# EAGLE design Esp32_Shield (EAGLE 9.6.2)
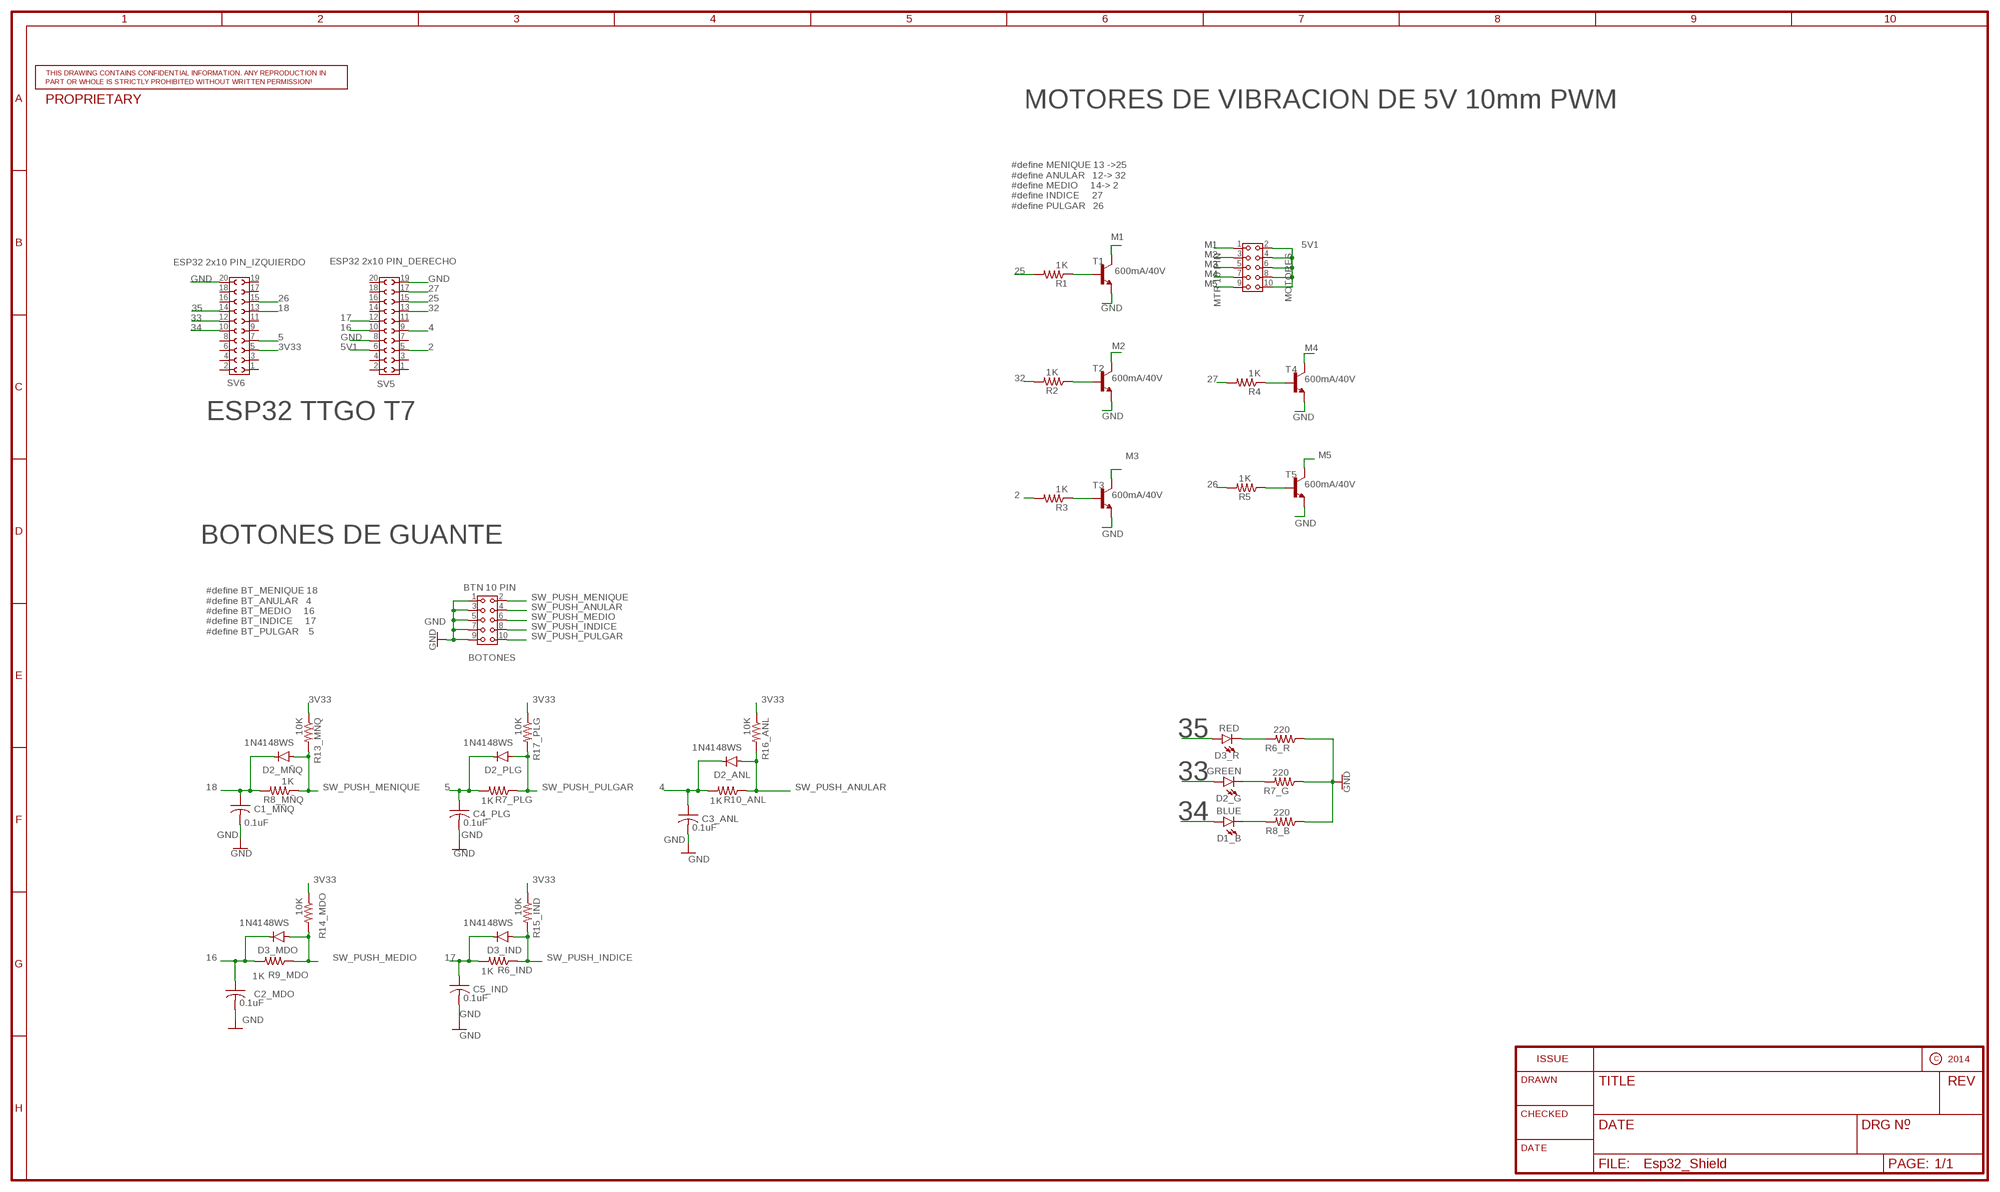
[diagram p0: schematic, sheet 1]

## Parts
BOTONES  BTN 10 PIN  6130XX21821_61301021821  [61301021821]
C1_MÑQ  0.1uF  C-USC0805  [C0805]
C2_MDO  0.1uF  C-USC0805  [C0805]
C3_ANL  0.1uF  C-USC0805  [C0805]
C4_PLG  0.1uF  C-USC0805  [C0805]
C5_IND  0.1uF  C-USC0805  [C0805]
D1_B  BLUE  LED-BLUE1206  [LED-1206]
D2_ANL  1N4148WS  [SOD-323]
D2_G  GREEN  LED-GREEN1206  [LED-1206]
D2_MÑQ  1N4148WS  [SOD-323]
D2_PLG  1N4148WS  [SOD-323]
D3_IND  1N4148WS  [SOD-323]
D3_MDO  1N4148WS  [SOD-323]
D3_R  RED  LED-RED1206  [LED-1206]
MOTORES  MTR 10 PIN  6130XX21821_61301021821  [61301021821]
R1  1K  R-US_R0805  [R0805]
R2  1K  R-US_R0805  [R0805]
R3  1K  R-US_R0805  [R0805]
R4  1K  R-US_R0805  [R0805]
R5  1K  R-US_R0805  [R0805]
R6_IND  1K  R-US_R0805  [R0805]
R6_R  220  R-US_R0805  [R0805]
R7_G  220  R-US_R0805  [R0805]
R7_PLG  1K  R-US_R0805  [R0805]
R8_B  220  R-US_R0805  [R0805]
R8_MÑQ  1K  R-US_R0805  [R0805]
R9_MDO  1K  R-US_R0805  [R0805]
R10_ANL  1K  R-US_R0805  [R0805]
R13_MÑQ  10K  R-US_R0805  [R0805]
R14_MDO  10K  R-US_R0805  [R0805]
R15_IND  10K  R-US_R0805  [R0805]
R16_ANL  10K  R-US_R0805  [R0805]
R17_PLG  10K  R-US_R0805  [R0805]
SV5  ESP32 2x10 PIN_DERECHO  6130XX21821_61302021821  [61302021821]
SV6  ESP32 2x10 PIN_IZQUIERDO  6130XX21821_61302021821  [61302021821]
T1  600mA/40V  TRANS_NPN-MMBT2222AL  [SOT23-3]
T2  600mA/40V  TRANS_NPN-MMBT2222AL  [SOT23-3]
T3  600mA/40V  TRANS_NPN-MMBT2222AL  [SOT23-3]
T4  600mA/40V  TRANS_NPN-MMBT2222AL  [SOT23-3]
T5  600mA/40V  TRANS_NPN-MMBT2222AL  [SOT23-3]

## Nets
2: R3.2 SV5.5
3V33: R13_MÑQ.1 R14_MDO.1 R15_IND.1 R16_ANL.1 R17_PLG.1 SV6.5
4: C3_ANL.1 D2_ANL.C R10_ANL.2 SV5.9
5: C4_PLG.1 D2_PLG.C R7_PLG.2 SV6.7
5V1: MOTORES.2 MOTORES.4 MOTORES.6 MOTORES.8 MOTORES.10 SV5.6
16: C2_MDO.1 D3_MDO.C R9_MDO.2 SV5.10
17: C5_IND.1 D3_IND.C R6_IND.2 SV5.12
18: C1_MÑQ.1 D2_MÑQ.C R8_MÑQ.2 SV6.13
25: R1.2 SV5.15
26: R5.2 SV6.15
27: R4.2 SV5.17
32: R2.2 SV5.13
33: D2_G.A SV6.12
34: D1_B.A SV6.10
35: D3_R.A SV6.14
GND: BOTONES.1 BOTONES.3 BOTONES.5 BOTONES.7 BOTONES.9 C1_MÑQ.2 C2_MDO.2 C3_ANL.2 C4_PLG.2 C5_IND.2 R6_R.1 R7_G.1 R8_B.1 SV5.8 SV5.19 SV6.20 T1.2(E) T2.2(E) T3.2(E) T4.2(E) T5.2(E)
M1: MOTORES.1 T1.3(C)
M2: MOTORES.3 T2.3(C)
M3: MOTORES.5 T3.3(C)
M4: MOTORES.7 T4.3(C)
M5: MOTORES.9 T5.3(C)
N$1: R2.1 T2.1(B)
N$2: R1.1 T1.1(B)
N$3: R3.1 T3.1(B)
N$4: D3_R.C R6_R.2
N$5: D2_G.C R7_G.2
N$6: D1_B.C R8_B.2
N$11: R4.1 T4.1(B)
N$13: R5.1 T5.1(B)
SW_PUSH_ANULAR: BOTONES.4 D2_ANL.A R10_ANL.1 R16_ANL.2
SW_PUSH_INDICE: BOTONES.8 D3_IND.A R6_IND.1 R15_IND.2
SW_PUSH_MEDIO: BOTONES.6 D3_MDO.A R9_MDO.1 R14_MDO.2
SW_PUSH_MENIQUE: BOTONES.2 D2_MÑQ.A R8_MÑQ.1 R13_MÑQ.2
SW_PUSH_PULGAR: BOTONES.10 D2_PLG.A R7_PLG.1 R17_PLG.2
Unconnected: SV5.1 SV5.2 SV5.3 SV5.4 SV5.7 SV5.11 SV5.14 SV5.16 SV5.18 SV5.20 SV6.1 SV6.2 SV6.3 SV6.4 SV6.6 SV6.8 SV6.9 SV6.11 SV6.16 SV6.17 SV6.18 SV6.19

## Notes on the sheet
- MOTORES DE VIBRACION DE 5V 10mm PWM
- #define MENIQUE 13 ->25
  #define ANULAR   12-> 32
  #define MEDIO     14-> 2
  #define INDICE     27
  #define PULGAR   26
- ESP32 TTGO T7
- BOTONES DE GUANTE
- #define BT_MENIQUE 18
  #define BT_ANULAR   4
  #define BT_MEDIO     16
  #define BT_INDICE     17
  #define BT_PULGAR    5

## Library data of the parts
BOTONES MOTORES = Wurth_Connectors_WR-PHD:6130XX21821_61301021821: WR-PHD 2.54 mm Dual Socket Header ARTICLE PROPERTIES: Pins:4;​ 6;​ 8;​ 10;​ 12;​ 14;​ 16;​ 18;​ 20;​ 22;​ 24;​ 26;​ 28;​ 30;​ 32;​ 34;​ 36;​ 40;​ 44;​ 64;​ 72 KIND PROPERTIES: Pitch：2.54 mm Quality Class:3 as per CECC 75 301-802 Rows：Dual Gender：Socket Header Type：Straight MATERIAL PROPERTIES: Insulator Material :PBT Insulator Flammability Rating:UL94 V-0 Contact Material:Copper Alloy Contact Plating:Gold Contact Type:Stamped GENERAL INFORMATION Operating Temperature:-40 up to +125 °C Compliance:Lead free / RoHS ELECTRICAL PROPERTIES: Rated Current:3 A IR 1:3 A Withstanding Voltage:500 V (AC) Contact Resistance:20 mΩ RISO:1000 MΩ CERTIFICATION UL Approval:E323964 PACKAGING PROPERTIES Packaging:Tray <https://katalog.we-online.com/media/images/v2/o57948v209%20Family_Dual_Socket_Header_WR-PHD_6130xx21821.jpg> Details see: https://katalog.we-online.com/en/em/PHD_2_54_DUAL_SOCKET_HEADER_6130XX21821 Updated by Yingchun,Shan 2019-10-21 2019 (C) Würth Elektronik; DATASHEET-URL: https://katalog.we-online.com/em/datasheet/61301021821.pdf; GENDER: Socket Header; IR: 3A; MATES: WR-PHD 2.54mm SMT Dual Pin Header/THT Angled Dual Pin Header/THT Dual Board Stacker/THT Dual Pin Header; PACKAGING: Tray; PART-NUMBER: 61301021821; PINS: 10; ROWS: Dual; TYPE: Straight
C1_MÑQ C2_MDO C3_ANL C4_PLG C5_IND = resistor:C-US: CAPACITOR, American symbol
D1_B = SparkFun-LED:LED-BLUE: Blue SMD LED Used in manufacturing of various products at SparkFun Packages: 0603 - SMD 0603 package [Product Link] <http://www.digikey.com/product-detail/en/SMLE12BC7TT86/511-1589-2-ND/1641808> 1206 - SMD1206 package [Product Link] <http://www.digikey.com/product-detail/en/lite-on-inc/LTST-C150TBKT/160-1643-1-ND/573584> SparkFun Products: ESP8266 Thing-Dev Board <https://www.sparkfun.com/products/13711> RedBoard <https://www.sparkfun.com/products/12757>; PROD_ID: DIO-09911
D2_ANL D2_MÑQ D2_PLG D3_IND D3_MDO = Diodes:1N4148WS: DIODE GEN PURP 75V 150MA SOD323F Manufacturer's datasheet <https://www.onsemi.com/pub/Collateral/1N914BWS-D.pdf>; CREATED_BY: PCBLayout.com; DIGIKEY_PART_NUMBER: 1N4148WSFSTR-ND; MANUFACTURER: Diodes Incorporated; MPN: 1N4148WS; PACKAGE: SOD-323
D2_G = SparkFun-LED:LED-GREEN: Green SMD LED Used in manufacturing of various products at SparkFun Packages: 0603 - SMD 0603 package [Product Link] <http://www.futureelectronics.com/en/technologies/semiconductors/optoelectronics/leds/Pages/9894312-LTST-C190GKT.aspx?CrossPart=HSMG-C190&IM=0> LilyPad 1206 - SMD1206 LilyPad package [Product Link] <http://www.futureelectronics.com/en/Technologies/Product.aspx?ProductID=IN150NGHARVATEKCORPORATION2049943&IM=0> 1206 - SMD1206 package [Product Link] <http://www.futureelectronics.com/en/technologies/semiconductors/optoelectronics/leds/Pages/8315665-LTST-C150KGKT.aspx?IM=0> 1206 Bottom Mount -SMD 1206 Bottom Mount [Product Link] <http://www.digikey.com/product-detail/en/lite-on-inc/LTST-C230KGKT/160-1456-1-ND/386854> SparkFun Products: Pro Mini 328 -5V <https://www.sparkfun.com/products/821> RedBoard <https://www.sparkfun.com/products/12757> MP3 Trigger <https://www.sparkfun.com/products/13720> Makey Makey <https://www.sparkfun.com/products/11076>; PROD_ID: DIO-00862
D3_R = SparkFun-LED:LED-RED: Red SMD LED Used in manufacturing of most products at SparkFun Packages: 0603 - SMD 0603 package [Product Link] <http://docs.avagotech.com/docs/AV02-0551EN> 0603 SMART - SMD 0603 SMART package ( more efficient and expensive)[Product Link] <http://www.osram-os.com/Graphics/XPic2/00077099_0.pdf> 1206 - SMD1206 package [Product Link] <https://www.sparkfun.com/datasheets/DevTools/LilyPad/Q150OVS4.pdff> SparkFun Products: Pro Mini 328 -5V <https://www.sparkfun.com/products/821> RedBoard <https://www.sparkfun.com/products/12757> IOIO-OTG <https://www.sparkfun.com/products/13613>; PROD_ID: DIO-09912
R1-R5 R6_IND R6_R R7_G R7_PLG R8_B R8_MÑQ R9_MDO R10_ANL R13_MÑQ R14_MDO R15_IND R16_ANL R17_PLG = resistor:R-US_: RESISTOR, American symbol
SV5 SV6 = Wurth_Connectors_WR-PHD:6130XX21821_61302021821: WR-PHD 2.54 mm Dual Socket Header ARTICLE PROPERTIES: Pins:4;​ 6;​ 8;​ 10;​ 12;​ 14;​ 16;​ 18;​ 20;​ 22;​ 24;​ 26;​ 28;​ 30;​ 32;​ 34;​ 36;​ 40;​ 44;​ 64;​ 72 KIND PROPERTIES: Pitch：2.54 mm Quality Class:3 as per CECC 75 301-802 Rows：Dual Gender：Socket Header Type：Straight MATERIAL PROPERTIES: Insulator Material :PBT Insulator Flammability Rating:UL94 V-0 Contact Material:Copper Alloy Contact Plating:Gold Contact Type:Stamped GENERAL INFORMATION Operating Temperature:-40 up to +125 °C Compliance:Lead free / RoHS ELECTRICAL PROPERTIES: Rated Current:3 A IR 1:3 A Withstanding Voltage:500 V (AC) Contact Resistance:20 mΩ RISO:1000 MΩ CERTIFICATION UL Approval:E323964 PACKAGING PROPERTIES Packaging:Tray <https://katalog.we-online.com/media/images/v2/o57948v209%20Family_Dual_Socket_Header_WR-PHD_6130xx21821.jpg> Details see: https://katalog.we-online.com/en/em/PHD_2_54_DUAL_SOCKET_HEADER_6130XX21821 Updated by Yingchun,Shan 2019-10-21 2019 (C) Würth Elektronik; DATASHEET-URL: https://katalog.we-online.com/em/datasheet/61302021821.pdf; GENDER: Socket Header; IR: 3A; MATES: WR-PHD 2.54mm SMT Dual Pin Header/THT Angled Dual Pin Header/THT Dual Board Stacker/THT Dual Pin Header; PACKAGING: Tray; PART-NUMBER: 61302021821; PINS: 20; ROWS: Dual; TYPE: Straight
T1-T5 = SparkFun-DiscreteSemi:TRANS_NPN: NPN transistor Current controlled devices typically used to amplify current or used as a switch. BC547 - COM-08928 <http://www.sparkfun.com/products/8928> (TO-92 45V 100mA) (1.Collector 2.Base 3.Emitter) 2N3904 - COM-00521 <http://www.sparkfun.com/products/521> (TO-92 40V 200mA) (1.Emitter 2.Base 3.Collector) P2N2222A - COM-12852 <http://www.sparkfun.com/products/12852> (TO-92 40V 600mA) (1.Collector 2.Base 3.Emitter); PROD_ID: TRANS-08049

## Board
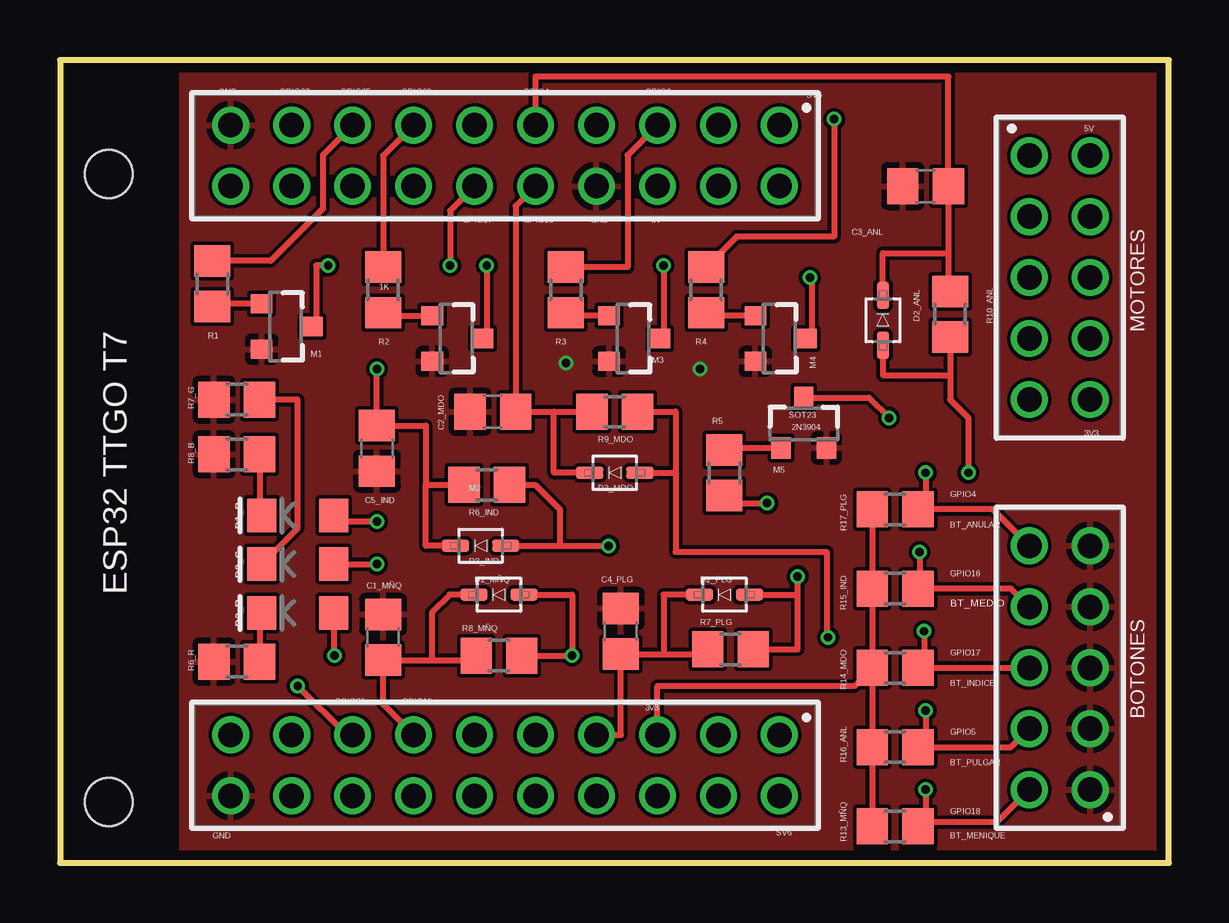
[diagram p1: board, top side]
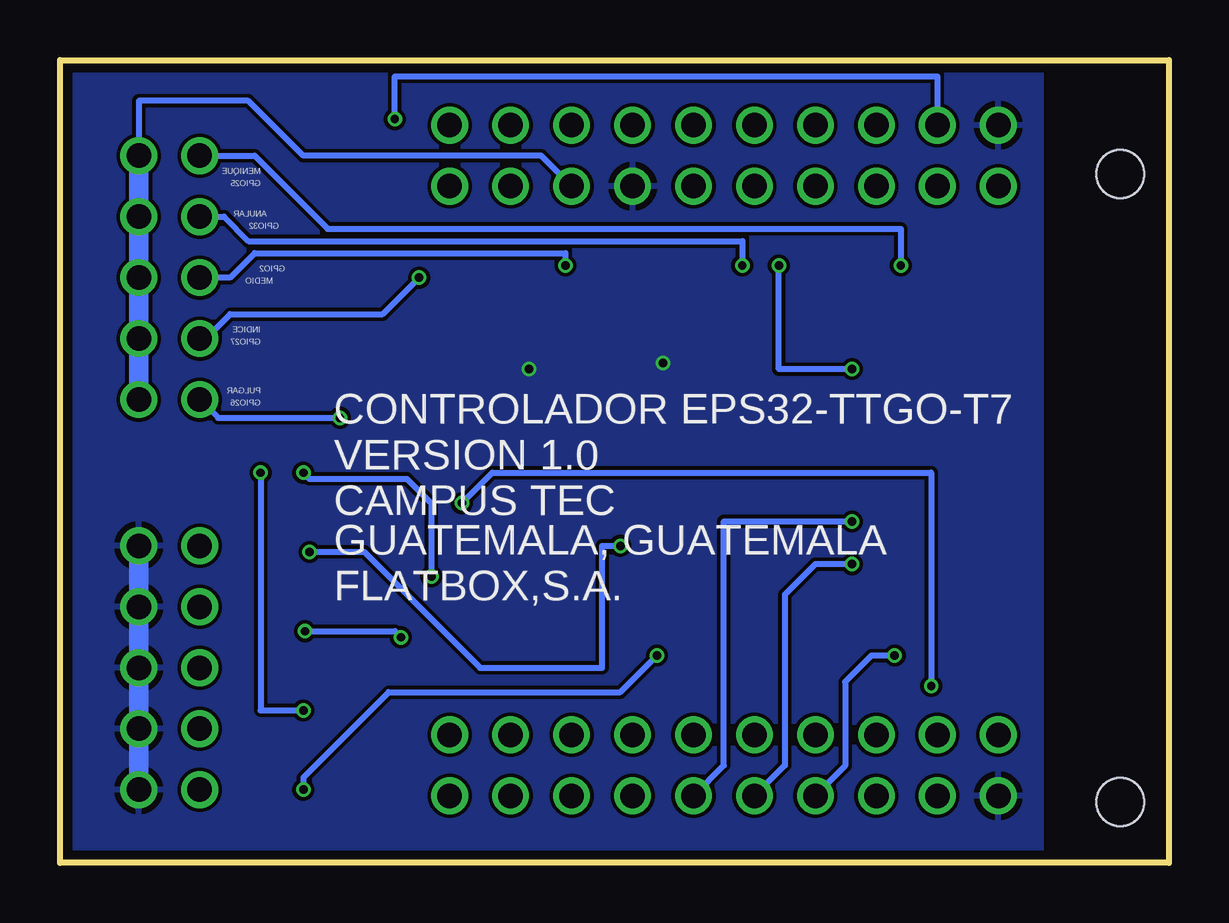
[diagram p2: board, bottom side, seen from below]

Size 46.21 x 33.45 mm. Coordinates in mm from the lower left corner, seen from the top.
Outline: 0,0 46.21,0 46.21,33.45 0,33.45 0,0
Copper layers (1*16): Top 0.035559375mm / dielectric 1.6mm / Bottom 0.035559375mm
Design rules "oshpark-2layer": minimum track width 6mil, minimum drill 10mil, track to track 6mil, track to pad 6mil, pad to pad 6mil, via to via 6mil, smd to smd 6mil, copper to edge 15mil, drill to drill 6mil, minimum pad ring 5mil, minimum via ring 5mil, stop-mask expansion 2.5mil, vias tented up to drill 0mil, thermal gap 10mil
Holes 2 mm at 2.03,28.7 2.03,2.54

### Footprints (pad centres in the part's own frame; a part is rotated, then mirrored left to right if it is on the bottom)
61301021821 = drill 1.02: 1 -5.08,-1.27; 2 -5.08,1.27; 3 -2.54,-1.27; 4 -2.54,1.27; 5 0,-1.27; 6 0,1.27; 7 2.54,-1.27; 8 2.54,1.27; 9 5.08,-1.27; 10 5.08,1.27
C0805 = smd 1.3 x 1.5: 1 -0.95,0; 2 0.95,0
LED-1206 = smd 1.2 x 1.4: A -1.5,0; C 1.5,0
SOD-323 = smd 1.14 x 0.52: A 1.04,0; C -1.04,0
R0805 = smd 1.3 x 1.5: 1 -0.95,0; 2 0.95,0
61302021821 = drill 1.02: 1 -11.43,-1.27; 2 -11.43,1.27; 3 -8.89,-1.27; 4 -8.89,1.27; 5 -6.35,-1.27; 6 -6.35,1.27; 7 -3.81,-1.27; 8 -3.81,1.27; 9 -1.27,-1.27; 10 -1.27,1.27; 11 1.27,-1.27; 12 1.27,1.27; 13 3.81,-1.27; 14 3.81,1.27; 15 6.35,-1.27; 16 6.35,1.27; 17 8.89,-1.27; 18 8.89,1.27; 19 11.43,-1.27; 20 11.43,1.27
SOT23-3 = smd 0.8 x 0.9: 1 -0.95,-1; 2 0.95,-1; 3 0,1.1

### Placement (x,y rotation side)
BOTONES  41.66,8.13 90 top
C1_MÑQ  13.46,9.4 90 top
C2_MDO  18.03,18.8 180 top
C3_ANL  36.07,28.19 180 top
C4_PLG  23.37,9.65 90 top
C5_IND  13.21,17.27 270 top
D1_B  9.91,14.48 180 top
D2_ANL  34.29,22.61 270 top
D2_G  9.91,12.45 180 top
D2_MÑQ  18.29,11.18 0 top
D2_PLG  27.69,11.18 0 top
D3_IND  17.53,13.21 0 top
D3_MDO  23.11,16.26 0 top
D3_R  9.91,10.41 180 top
MOTORES  41.66,24.38 270 top
R1  6.35,24.13 90 top
R2  13.46,23.88 90 top
R3  21.08,23.88 90 top
R4  26.92,23.88 90 top
R5  27.69,16.26 270 top
R6_IND  17.78,15.75 180 top
R6_R  7.37,8.38 0 top
R7_G  7.37,19.3 0 top
R7_PLG  27.94,8.89 180 top
R8_B  7.37,17.02 0 top
R8_MÑQ  18.29,8.64 180 top
R9_MDO  23.11,18.8 180 top
R10_ANL  37.08,22.86 90 top
R13_MÑQ  34.8,1.52 0 top
R14_MDO  34.8,8.13 0 top
R15_IND  34.8,11.43 0 top
R16_ANL  34.8,4.83 0 top
R17_PLG  34.8,14.73 0 top
SV5  18.54,29.46 180 top
SV6  18.54,4.06 180 top
T1  9.4,22.35 270 top
T2  16.51,21.84 270 top
T3  23.88,21.84 270 top
T4  29.97,21.84 270 top
T5  30.99,18.29 0 top

### Tracks (layer width: path | path; a pad name or v marks a point on that pad's centre or on a via)
2
  Top 0.254: SV5.5 23.65,29.49 23.65,24.83 R3.2
3V33
  Top 0.254: R14_MDO.1 R15_IND.1 R17_PLG.1 | SV6.5 24.89,7.37 33.09,7.37 R14_MDO.1 | R13_MÑQ.1 R16_ANL.1 R14_MDO.1
4
  Top 0.254: SV5.9 19.81,32.77 37.02,32.77 C3_ANL.1 37.02,25.4 | 37.02,25.4 37.02,23.81 R10_ANL.2 | D2_ANL.C 34.29,25.4 37.02,25.4
5
  Top 0.254: SV6.7 23.37,5.33 C4_PLG.1 25.15,8.7 | 25.15,8.7 26.99,8.7 R7_PLG.2 | D2_PLG.C 25.15,11.18 25.15,8.7
5V1
  Bottom 0.254: SV5.6 26.16,29.46 36.07,29.46 38.35,31.75 42.93,31.75 MOTORES.2
  Bottom 0.813: MOTORES.2 MOTORES.4 MOTORES.6 MOTORES.8 MOTORES.10
16
  Top 0.254: SV5.10 18.98,27.37 C2_MDO.1 20.57,18.8 | 20.57,18.8 R9_MDO.2 | D3_MDO.C 20.57,16.26 20.57,18.8
17  (via drill 0.35)
  Top 0.254: SV5.12 16.26,27.18 v16.26,24.89 | v13.21,20.57 C5_IND.1 15.24,18.22 15.24,15.75 | 15.24,15.75 R6_IND.2 | D3_IND.C 15.24,13.21 15.24,15.75
  Bottom 0.254: v13.21,20.57 16.26,20.57 v16.26,24.89
18
  Top 0.254: SV6.13 13.46,6.6 C1_MÑQ.1 15.49,8.45 | 15.49,8.45 17.15,8.45 R8_MÑQ.2 | D2_MÑQ.C 16.23,11.18 15.49,10.44 15.49,8.45
25
  Top 0.254: SV5.15 10.95,29.49 10.95,27.25 8.78,25.08 R1.2
26  (via drill 0.35)
  Top 0.254: SV6.15 11.94,5.33 v9.91,7.37 | R5.2 28.01,14.99 v29.46,14.99
  Bottom 0.254: v29.46,14.99 28.19,16.26 9.91,16.26 v9.91,7.37
27  (via drill 0.35)
  Top 0.254: R4.2 28.19,26.1 32.26,26.1 v32.26,30.99
  Bottom 0.254: v32.26,30.99 32.26,32.77 9.65,32.77 SV5.17
32
  Top 0.254: SV5.13 13.46,29.46 R2.2
33  (via drill 0.35)
  Top 0.254: D2_G.A v13.21,12.45
  Bottom 0.254: v13.21,12.45 14.73,12.45 16,11.18 16,4.06 SV6.12
34  (via drill 0.35)
  Top 0.254: D1_B.A 11.66,14.22 v13.21,14.22
  Bottom 0.254: v13.21,14.22 18.54,14.22 18.54,4.06 SV6.10
35  (via drill 0.35)
  Top 0.254: D3_R.A 11.41,8.66 v11.43,8.64
  Bottom 0.254: SV6.14 13.49,4.04 13.49,7.54 12.4,8.64 v11.43,8.64
GND  (via drill 0.35)
  Bottom 0.813: BOTONES.9 BOTONES.7 BOTONES.5 BOTONES.3 BOTONES.1
  other vias: 21.08,20.83 26.67,20.57
  pour Top: 5.08,34.54 5.08,-0.51 47.75,-0.51 47.75,34.54
  pour Bottom: 5.33,34.54 5.33,-1.02 47.24,-1.02 47.24,34.54
M1  (via drill 0.35)
  Top 0.254: T1.3 10.67,22.52 10.67,24.89 v11.18,24.89
  Bottom 0.254: MOTORES.1 38.1,29.46 35.05,26.42 11.18,26.42 v11.18,24.89
M2  (via drill 0.35)
  Top 0.254: v17.78,24.89 17.78,22.01 T2.3
  Bottom 0.254: MOTORES.3 39.37,26.92 38.35,25.91 17.78,25.91 v17.78,24.89
M3  (via drill 0.35)
  Top 0.254: v25.15,24.89 25.15,22.01 T3.3
  Bottom 0.254: v25.15,24.89 25.15,25.4 38.1,25.4 39.12,24.38 MOTORES.5
M4  (via drill 0.35)
  Top 0.254: v31.24,24.38 31.33,24.3 31.33,22.1 T4.3
  Bottom 0.254: MOTORES.7 40.13,21.84 39.12,22.86 32.77,22.86 v31.24,24.38
M5  (via drill 0.35)
  Top 0.254: T5.3 33.7,19.39 v34.54,18.54
  Bottom 0.254: v34.54,18.54 39.62,18.54 MOTORES.9
N$1
  Top 0.254: R2.1 13.59,22.79 T2.1
N$2
  Top 0.254: R1.1 6.47,23.3 T1.1
N$3
  Top 0.254: T3.1 21.21,22.79 R3.1
N$4
  Top 0.254: D3_R.C 8.32,10.32 R6_R.2
N$5
  Top 0.254: D2_G.C 9.91,13.95 9.91,19.3 R7_G.2
N$6
  Top 0.254: R8_B.2 8.32,14.57 D1_B.C
N$11
  Top 0.254: R4.1 27.06,22.79 T4.1
N$13
  Top 0.254: R5.1 27.77,17.29 T5.1
SW_PUSH_ANULAR  (via drill 0.35)
  Top 0.254: D2_ANL.A 34.29,20.32 37.08,20.32 | v36.07,6.35 36.07,4.83 R16_ANL.2 39.62,4.83 BOTONES.4 | R10_ANL.1 37.08,20.32 | 37.08,20.32 37.08,19.3 37.85,18.54 v37.85,16.26
  Bottom 0.254: v37.85,16.26 37.85,6.35 v36.07,6.35
SW_PUSH_INDICE  (via drill 0.35)
  Top 0.254: v35.81,12.95 35.81,11.5 R15_IND.2 39.62,11.43 BOTONES.8 | D3_IND.A 20.83,13.21 | 20.83,13.21 v22.86,13.21 | R6_IND.1 19.81,15.75 20.83,14.73 20.83,13.21
  Bottom 0.254: v35.81,12.95 33.53,12.95 28.7,8.13 23.62,8.13 23.62,13.21 v22.86,13.21
SW_PUSH_MEDIO  (via drill 0.35)
  Top 0.254: R9_MDO.1 25.65,18.8 25.65,16.26 | 25.65,16.26 25.65,12.95 31.94,12.95 31.94,9.4 v32,9.4 | v36,9.65 36,8.38 R14_MDO.2 BOTONES.6 | D3_MDO.A 25.65,16.26
  Bottom 0.254: v36,9.65 32.26,9.65 v32,9.4
SW_PUSH_MENIQUE  (via drill 0.35)
  Top 0.254: R8_MÑQ.1 v21.34,8.64 21.34,11.18 D2_MÑQ.A | v36.07,3.05 36.07,1.84 35.91,1.68 | 35.91,1.68 R13_MÑQ.2 | BOTONES.2 39.02,1.68 35.91,1.68
  Bottom 0.254: v36.07,3.05 36.07,3.56 32.51,7.11 22.86,7.11 v21.34,8.64
SW_PUSH_PULGAR  (via drill 0.35)
  Top 0.254: R7_PLG.1 30.73,8.89 v30.73,11.94 30.73,11.18 D2_PLG.A | v36.07,16.26 36.07,14.73 R17_PLG.2 38.86,14.73 BOTONES.10
  Bottom 0.254: v30.73,11.94 30.73,14.99 31.75,16 35.81,16 v36.07,16.26

### Text on the board
tNames: GND | GPIO27 | GPIO25 | GPIO32 | GPIO4 | GPIO2 | 5V | GPIO17 | GPIO16 | GND | 5V | 1K | M1 | M3 | M4 | SOT23 | 2N3904 | 3V3 | M5 | M2 | GPIO4 | BT_ANULAR | GPIO16 | ESP32 TTGO T7 | BT_MEDIO | GPIO17 | GPIO26 | GPIO18 | BT_INDICE | 3v3 | GPIO5 | BT_PULGAR | GPIO18 | GND | BT_MENIQUE
bNames: GPIO25 | MENIQUE | ANULAR | GPIO32 | GPIO2 | MEDIO | INDICE | GPIO27 | GPIO26 | PULGAR | CONTROLADOR EPS32-TTGO-T7 / VERSION 1.0 / CAMPUS TEC | FLATBOX,S.A. | GUATEMALA, GUATEMALA